# EAGLE design trackuino-standalone (EAGLE 5.08)
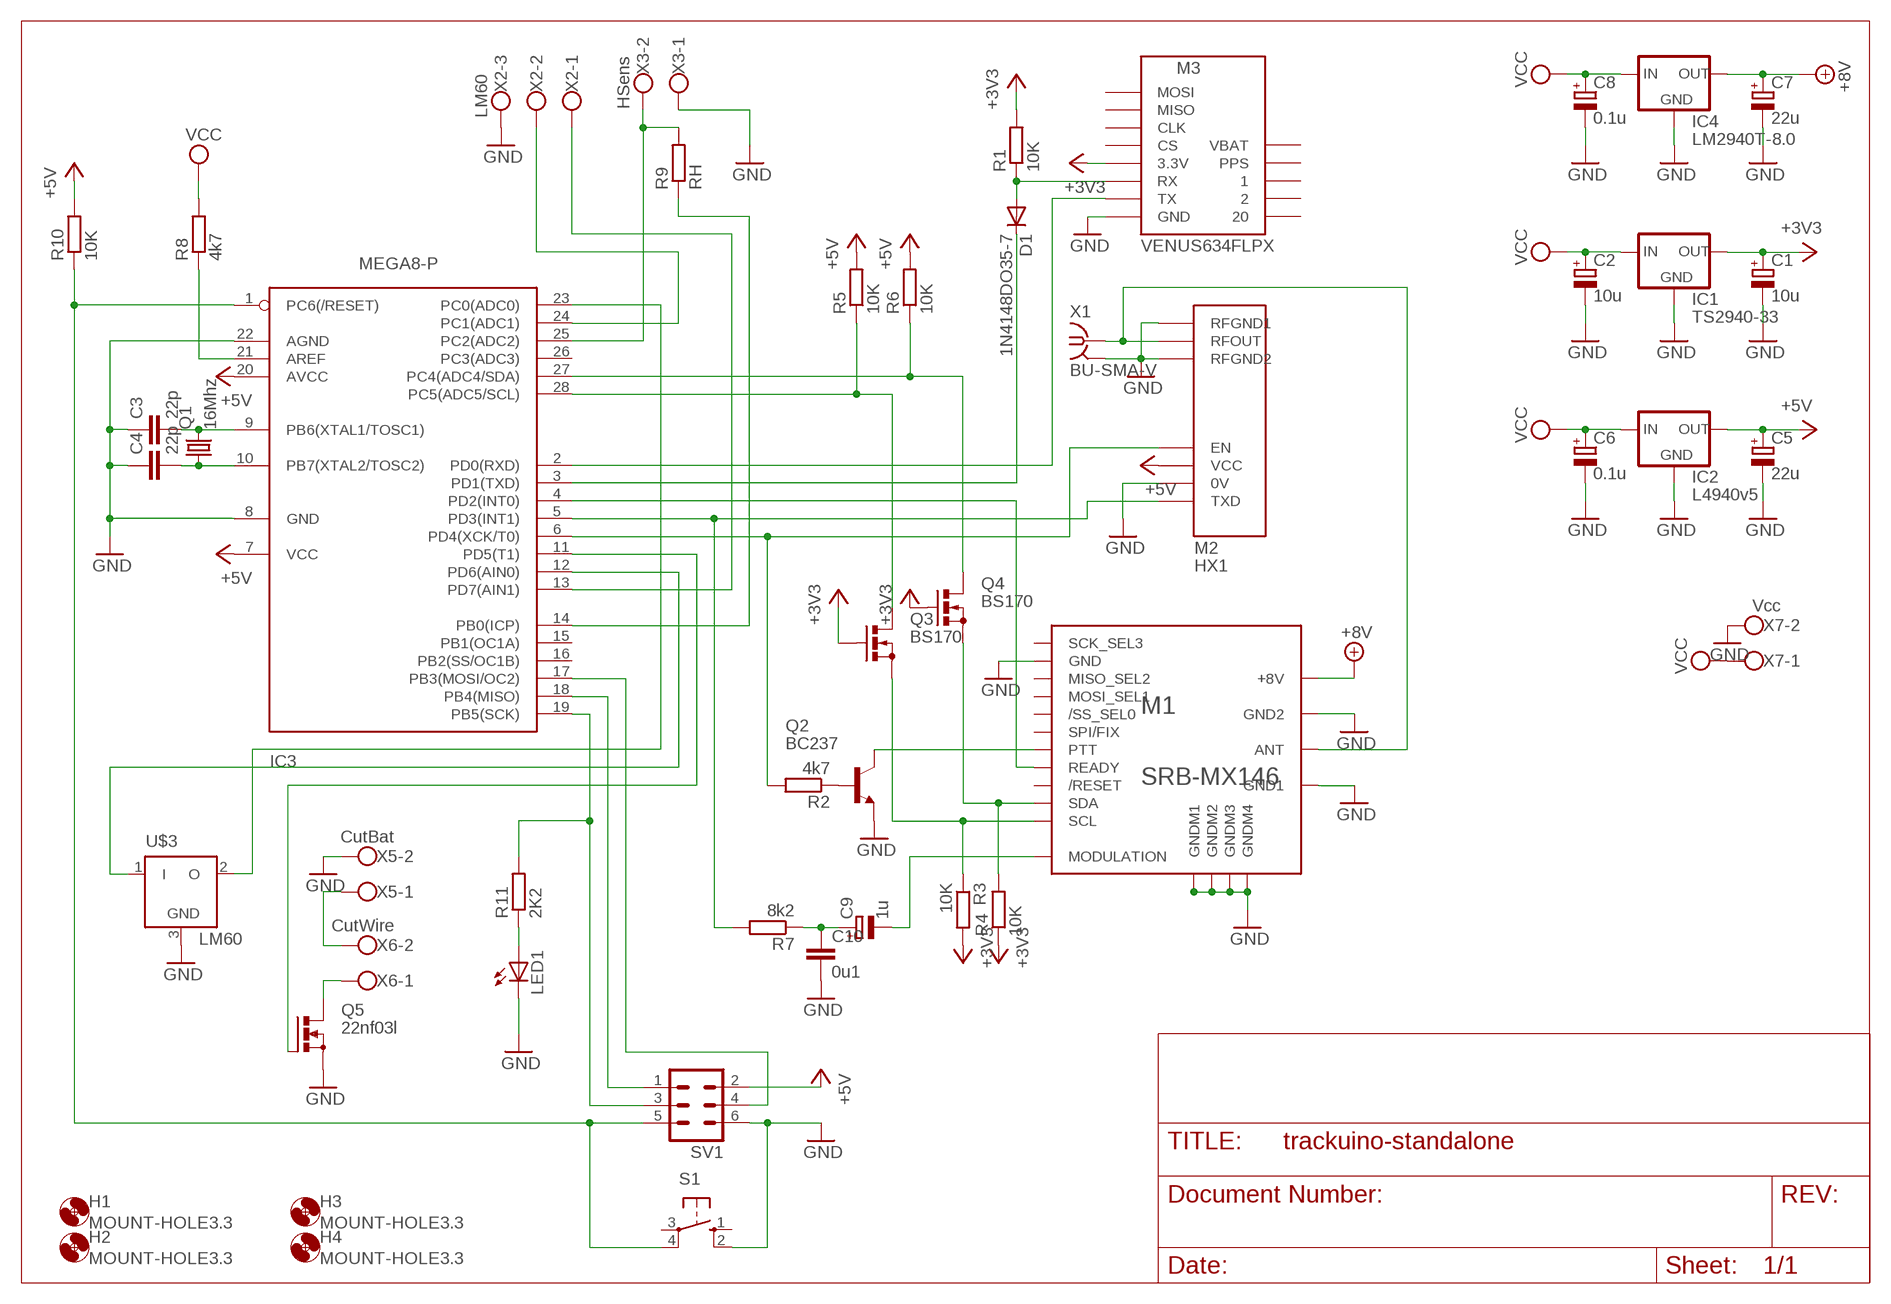
[diagram p0: schematic, sheet 1]

## Parts
C1  10u  CPOL-EUE2.5-5  [E2,5-5]
C2  10u  CPOL-EUE2.5-5  [E2,5-5]
C3  22p  C-EU025-025X050  [C025-025X050]
C4  22p  C-EU025-025X050  [C025-025X050]
C5  22u  CPOL-EUE2.5-5  [E2,5-5]
C6  0.1u  CPOL-EUE2.5-5  [E2,5-5]
C7  22u  CPOL-EUE2.5-5  [E2,5-5]
C8  0.1u  CPOL-EUE2.5-5  [E2,5-5]
C9  1u  CPOL-EUE2.5-5  [E2,5-5]
C10  0u1  C-EU025-025X050  [C025-025X050]
D1  1N4148DO35-7  [DO35-7]
H1  MOUNT-HOLE3.3  [3,3]
H2  MOUNT-HOLE3.3  [3,3]
H3  MOUNT-HOLE3.3  [3,3]
H4  MOUNT-HOLE3.3  [3,3]
IC1  TS2940-33  78XXL  [78XXL]
IC2  L4940v5  78XXL  [78XXL]
IC3  MEGA8-P  [DIL28-3]
IC4  LM2940T-8.0  78XXL  [78XXL]
LED1  LED3MM  [LED3MM]
M1  SRB-MX146  [SRB-MX146]
M2  HX1  [HX1]
M3  VENUS634FLPX  [VENUS634FLPX]
Q1  16Mhz  CRYSTALHC49S  [HC49/S]
Q2  BC237  [TO92]
Q3  BS170  [SOT54E]
Q4  BS170  [SOT54E]
Q5  22nf03l  PMOSFET_NTO220BH  [TO220BH]
R1  10K  R-EU_0204/5  [0204/5]
R2  4k7  R-EU_0204/5  [0204/5]
R3  10K  R-EU_0204/5  [0204/5]
R4  10K  R-EU_0204/5  [0204/5]
R5  10K  R-EU_0204/5  [0204/5]
R6  10K  R-EU_0204/5  [0204/5]
R7  8k2  R-EU_0204/5  [0204/5]
R8  4k7  R-EU_0204/5  [0204/5]
R9  RH  R-EU_0204/5  [0204/5]
R10  10K  R-EU_0204/5  [0204/5]
R11  2K2  R-EU_0204/5  [0204/5]
S1  10-XX  [B3F-10XX]
SV1  MA03-2  [MA03-2]
U$3  LM60  [TO92]
X1  BU-SMA-V  [BU-SMA-V]
X2  LM60  W237-103  [W237-103]
X3  HSens  W237-102  [W237-102]
X5  CutBat  W237-102  [W237-102]
X6  CutWire  W237-102  [W237-102]
X7  Vcc  W237-102  [W237-102]

## Nets
+3V3: C1.+ IC1.OUT M3.3.3V Q3.G Q4.G R1.2 R3.2 R4.1
+5V: C5.+ IC2.OUT IC3.7(VCC) IC3.20(AVCC) M2.VCC R5.2 R6.2 R10.2 SV1.2
+8V: C7.+ IC4.OUT M1.+8V
GND: C1.- C2.- C3.1 C4.1 C5.- C6.- C7.- C8.- C10.2 IC1.GND IC2.GND IC3.8(GND) IC3.22(AGND) IC4.GND LED1.K(C) M1.GND M1.GND1 M1.GND2 M1.GNDM1 M1.GNDM2 M1.GNDM3 M1.GNDM4 M2.0V M2.RFGND1 M2.RFGND2 M3.GND Q2.1(E) Q5.S S1.2(S1) SV1.6 U$3.3(GND) X1.2(GND) X2.3 X3.1 X5.2 X7.2
N$1: IC3.21(AREF) R8.1
N$2: M1.ANT M2.RFOUT X1.1
N$3: C3.2 IC3.9(PB6(XTAL1/TOSC1)) Q1.2
N$4: C4.2 IC3.10(PB7(XTAL2/TOSC2)) Q1.1
N$5: IC3.4(PD2(INT0)) M1.PRE2(READY)
N$6: IC3.5(PD3(INT1)) M2.TXD R7.2
N$7: IC3.6(PD4(XCK/T0)) M2.EN R2.2
N$8: IC3.12(PD6(AIN0)) U$3.1(I)
N$9: IC3.2(PD0(RXD)) M3.TX
N$10: D1.C IC3.3(PD1(TXD))
N$11: D1.A M3.RX R1.1
N$12: IC3.14(PB0(ICP)) R9.1
N$13: C9.+ C10.1 R7.1
N$14: Q2.2(B) R2.1
N$15: M1.PRE1(PTT) Q2.3(C)
N$16: M1.SDA Q4.S R4.2
N$17: IC3.27(PC4(ADC4/SDA)) Q4.D R6.1
N$18: IC3.28(PC5(ADC5/SCL)) Q3.D R5.1
N$19: M1.SCL Q3.S R3.1
N$20: C9.- M1.MOD(MODULATION)
N$22: IC3.11(PD5(T1)) Q5.G
N$23 [HIGH Current]: X5.1 X6.2
N$24 [HIGH Current]: Q5.D X6.1
N$25: IC3.23(PC0(ADC0)) U$3.2(O)
N$26: IC3.13(PD7(AIN1)) X2.1
N$27: IC3.24(PC1(ADC1)) X2.2
N$29: IC3.18(PB4(MISO)) SV1.1
N$30: IC3.19(PB5(SCK)) R11.2 SV1.3
N$31: IC3.17(PB3(MOSI/OC2)) SV1.4
N$32: IC3.1(PC6(/RESET)) R10.1 S1.4(P1) SV1.5
N$33: LED1.A R11.1
N$77: IC3.25(PC2(ADC2)) R9.2 X3.2
VCC: C2.+ C6.+ C8.+ IC1.IN IC2.IN IC4.IN R8.2 X7.1
Unconnected: IC3.15(PB1(OC1A)) IC3.16(PB2(SS/OC1B)) IC3.26(PC3(ADC3)) M1./RES(/RESET) M1./SS(/SS_SEL0) M1.MISO(MISO_SEL2) M1.MOSI(MOSI_SEL1) M1.PRE0(SPI/FIX) M1.SCK(SCK_SEL3) M3.1 M3.2 M3.20 M3.CLK M3.CS M3.MISO M3.MOSI M3.PPS M3.VBAT S1.1(S) S1.3(P)

## Power pins joined to a net without a drawn wire
GND: X1.3(GND) X1.4(GND) X1.5(GND)

## Library data of the parts
C1 C2 C5-C9 = rcl:CPOL-EU: POLARIZED CAPACITOR, European symbol
C3 C4 C10 = rcl:C-EU: CAPACITOR, European symbol
D1 = diode:1N4148: DIODE high speed (Philips)
H1-H4 = holes:MOUNT-HOLE: MOUNTING HOLE with drill center marker
IC1 IC2 IC4 = v-reg:78XXL: VOLTAGE REGULATOR
IC3 = avr-6:MEGA8-P: MICROCONTROLLER 8 Kbytes FLASH 1 kbytes SRAM 512 bytes EEPROM USART 4-channel 10 bit ADC 2-channel 8 bit ADC
LED1 = led:LED: LED OSRAM: - CHIPLED LG R971, LG N971, LY N971, LG Q971, LY Q971, LO R971, LY R971 LH N974, LH R974 LS Q976, LO Q976, LY Q976 LO Q996 - Hyper CHIPLED LW Q18S LB Q993, LB Q99A, LB R99A - SideLED LS A670, LO A670, LY A670, LG A670, LP A670 LB A673, LV A673, LT A673, LW A673 LH A674 LY A675 LS A676, LA A676, LO A676, LY A676, LW A676 LS A679, LY A679, LG A679 - Hyper Micro SIDELED® LS Y876, LA Y876, LO Y876, LY Y876 LT Y87S - SmartLED LW L88C, LW L88S LB L89C, LB L89S, LG L890 LS L89K, LO L89K, LY L89K LS L896, LA L896, LO L896, LY L896 - TOPLED LS T670, LO T670, LY T670, LG T670, LP T670 LSG T670, LSP T670, LSY T670, LOP T670, LYG T670 LG T671, LOG T671, LSG T671 LB T673, LV T673, LT T673, LW T673 LH T674 LS T676, LA T676, LO T676, LY T676, LB T676, LH T676, LSB T676, LW T676 LB T67C, LV T67C, LT T67C, LS T67K, LO T67K, LY T67K, LW E67C LS E67B, LA E67B, LO E67B, LY E67B, LB E67C, LV E67C, LT E67C LW T67C LS T679, LY T679, LG T679 LS T770, LO T770, LY T770, LG T770, LP T770 LB T773, LV T773, LT T773, LW T773 LH T774 LS E675, LA E675, LY E675, LS T675 LS T776, LA T776, LO T776, LY T776, LB T776 LHGB T686 LT T68C, LB T68C - Hyper Mini TOPLED® LB M676 - Mini TOPLED Santana® LG M470 LS M47K, LO M47K, LY M47K Source: http://www.osram.convergy.de LUXEON: - LUMILED® LXK2-PW12-R00, LXK2-PW12-S00, LXK2-PW14-U00, LXK2-PW14-V00 LXK2-PM12-R00, LXK2-PM12-S00, LXK2-PM14-U00 LXK2-PE12-Q00, LXK2-PE12-R00, LXK2-PE12-S00, LXK2-PE14-T00, LXK2-PE14-U00 LXK2-PB12-K00, LXK2-PB12-L00, LXK2-PB12-M00, LXK2-PB14-N00, LXK2-PB14-P00, LXK2-PB14-Q00 LXK2-PR12-L00, LXK2-PR12-M00, LXK2-PR14-Q00, LXK2-PR14-R00 LXK2-PD12-Q00, LXK2-PD12-R00, LXK2-PD12-S00 LXK2-PH12-R00, LXK2-PH12-S00 LXK2-PL12-P00, LXK2-PL12-Q00, LXK2-PL12-R00 Source: www.luxeon.com KINGBRIGHT: KA-3528ASYC Source: www.kingbright.com
M1 = SRB:SRB-MX146: 2m/VHF transmitter module
M2 = trackuino:HX1
M3 = trackuino:VENUS634FLPX
Q1 = crystal:CRYSTAL: CRYSTAL
Q2 = transistor-npn:BC237: NPN Transistor
Q3 Q4 = transistor-small-signal:BS170: N-CHANNEL MOS FET
Q5 = transistor-power:PMOSFET_N: Power MOSFET N-Channel
R1-R11 = rcl:R-EU_: RESISTOR, European symbol
S1 = switch-omron:10-XX: OMRON SWITCH
SV1 = con-lstb:MA03-2: PIN HEADER
U$3 = trackuino:LM60
X1 = con-coax:BU-SMA-V: FEMALE SMA CONNECTOR Radiall distributor RS 112-3794
X2 = con-wago-500:W237-103: WAGO SCREW CLAMP
X3 X5-X7 = con-wago-500:W237-102: WAGO SCREW CLAMP

## Net classes
0 10: width 0.254 mm
1 15: width 0.381 mm
2 20: width 0.508 mm
3 30: width 0.762 mm
4 40: width 1.016 mm
5 50: width 1.27 mm
6 HIGH Current: width 2.54 mm

## Board
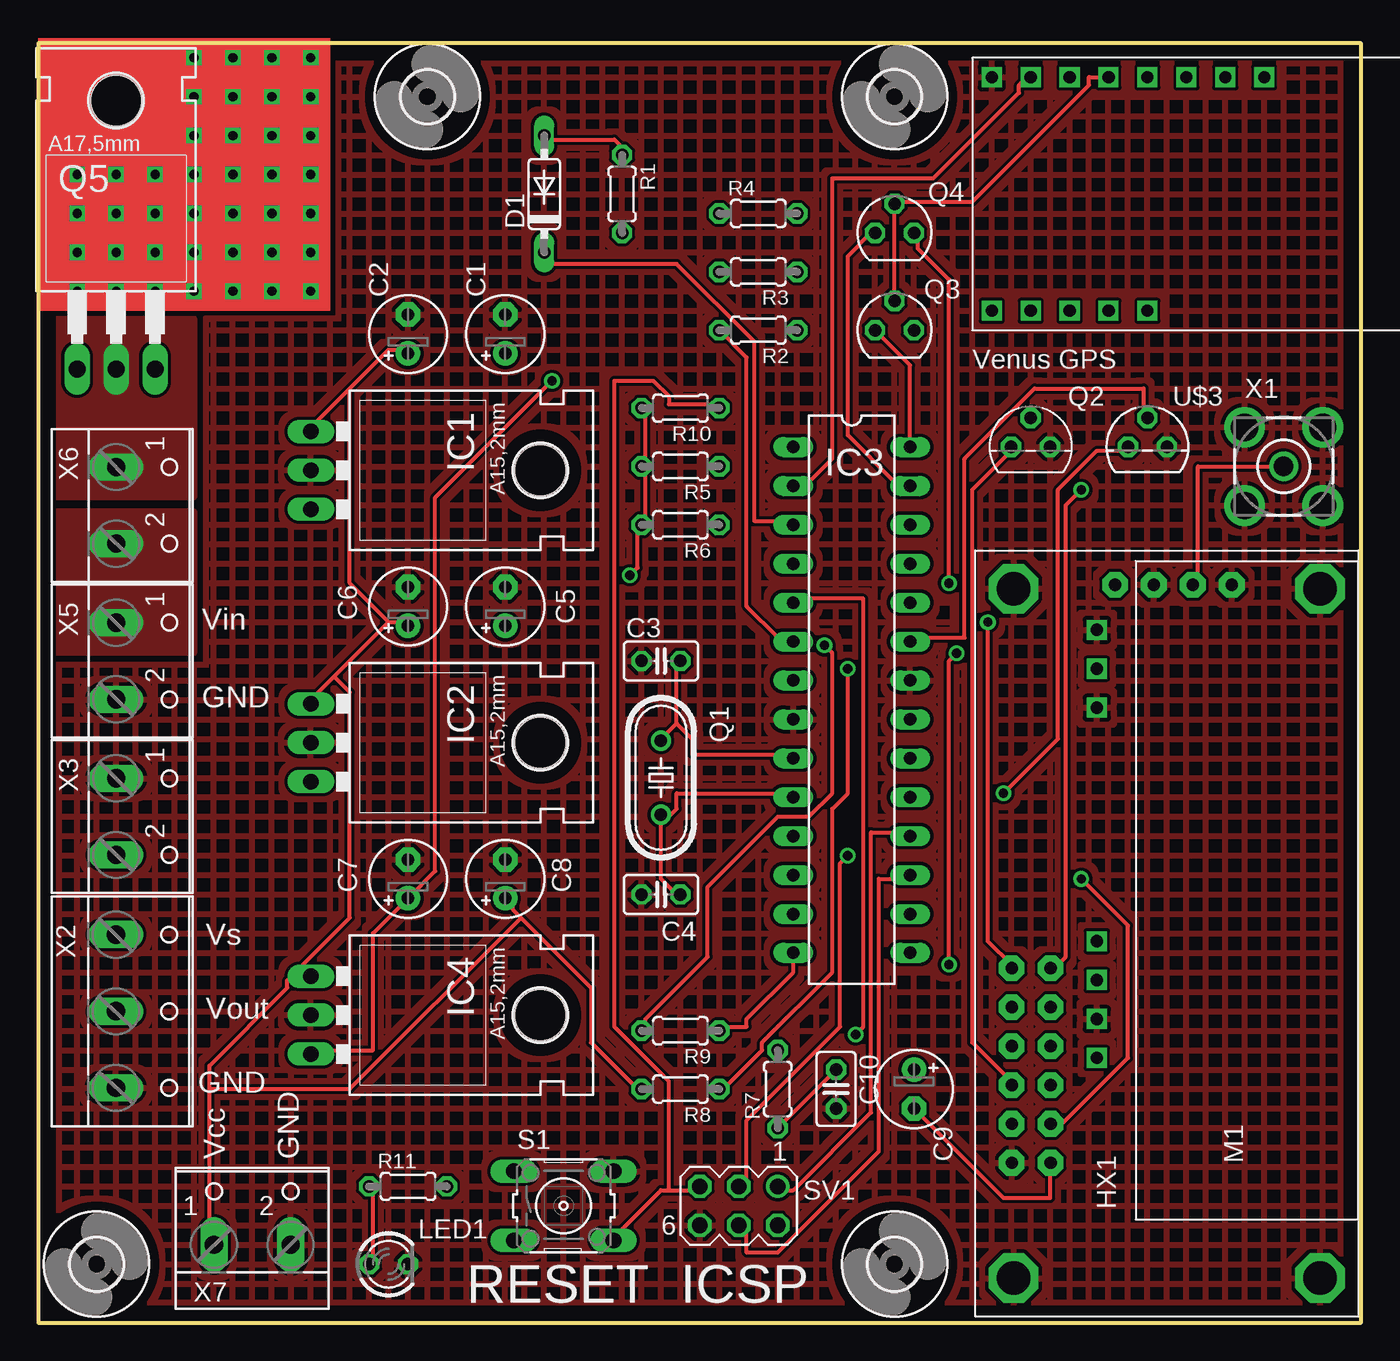
[diagram p1: board, top side]
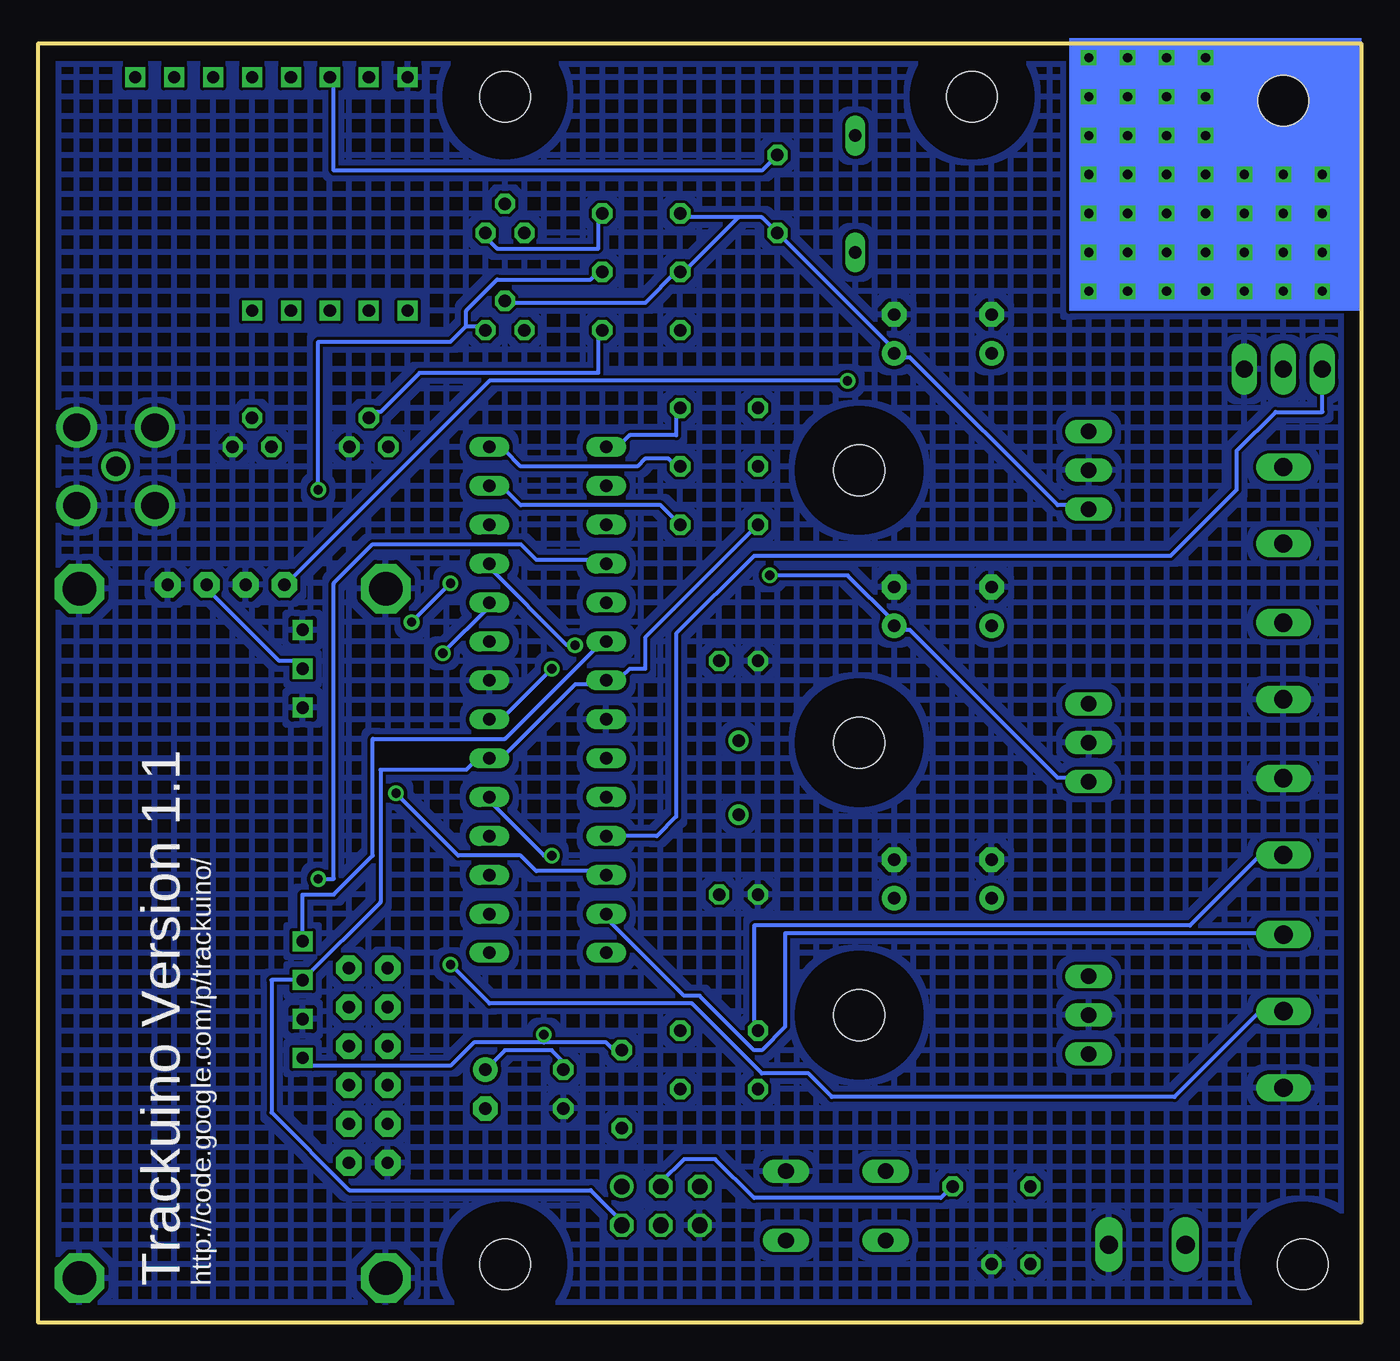
[diagram p2: board, bottom side, seen from below]

Size 86.34 x 83.49 mm. Coordinates in mm from the lower left corner, seen from the top.
Outline: 0,0 86.34,0 86.34,83.49 0,83.49 0,0
Copper layers (1*16): Top 0.035mm / dielectric 1.5mm / Bottom 0.035mm
Design rules "default": minimum track width 10mil, minimum drill 24mil, track to track 8mil, track to pad 8mil, pad to pad 8mil, via to via 8mil, smd to smd 8mil, copper to edge 40mil, drill to drill 8mil, minimum pad ring 10mil, minimum via ring 8mil, stop-mask expansion 4mil, vias tented up to drill 0mil, thermal gap 10mil

### Footprints (pad centres in the part's own frame; a part is rotated, then mirrored left to right if it is on the bottom)
E2,5-5 = drill 0.813 pad 1.6 round: + -1.27,0 | drill 0.813 pad 1.6 octagon: - 1.27,0
C025-025X050 = drill 0.813 octagon: 1 -1.27,0; 2 1.27,0
DO35-7 = drill 0.813 long: A 3.81,0; C -3.81,0
3,3 = hole 3.3: 0,0
78XXL = drill 1.016 long: GND 0,-3.81; IN -2.54,-3.81; OUT 2.54,-3.81 | hole 3.302: 0,11.176
DIL28-3 = drill 0.813 long: 1 -16.51,-3.81; 2 -13.97,-3.81; 3 -11.43,-3.81; 4 -8.89,-3.81; 5 -6.35,-3.81; 6 -3.81,-3.81; 7 -1.27,-3.81; 8 1.27,-3.81; 9 3.81,-3.81; 10 6.35,-3.81; 11 8.89,-3.81; 12 11.43,-3.81; 13 13.97,-3.81; 14 16.51,-3.81; 15 16.51,3.81; 16 13.97,3.81; 17 11.43,3.81; 18 8.89,3.81; 19 6.35,3.81; 20 3.81,3.81; 21 1.27,3.81; 22 -1.27,3.81; 23 -3.81,3.81; 24 -6.35,3.81; 25 -8.89,3.81; 26 -11.43,3.81; 27 -13.97,3.81; 28 -16.51,3.81
LED3MM = drill 0.813 octagon: A -1.27,0; K 1.27,0
SRB-MX146 = drill 0.8 pad 1.676 octagon: +8V 22.755,3.389; /RES -12.435,10.125; /SS -7.355,7.585; ANT 22.755,-1.691; GND -14.975,10.125; GND1 22.755,0.849; GND2 22.755,-4.231; MISO -4.815,7.585; MOD -14.975,7.585; MOSI -7.355,10.125; PRE0 -9.895,7.585; PRE1 -9.895,10.125; PRE2 -12.435,7.585; SCK -4.815,10.125; SCL -2.275,7.585; SDA -2.275,10.125 | drill 2.2 octagon: GNDM1 -22.5,10; GNDM2 22.5,10; GNDM3 22.5,-10; GNDM4 -22.5,-10
HX1 = drill 0.8 square: 0V 25.4,-8.89; EN 20.32,-8.89; RFGND1 0,-8.89; RFGND2 5.08,-8.89; RFOUT 2.54,-8.89; TXD 27.94,-8.89; VCC 22.86,-8.89
VENUS634FLPX = drill 0.8 square: 1 6.35,1.27; 2 3.81,1.27; 3.3V 8.89,16.51; 20 1.27,1.27; CLK 13.97,16.51; CS 11.43,16.51; GND 1.27,16.51; MISO 16.51,16.51; MOSI 19.05,16.51; PPS 8.89,1.27; RX 6.35,16.51; TX 3.81,16.51; VBAT 11.43,1.27
HC49/S = drill 0.813 round: 1 -2.413,0; 2 2.413,0
TO92 = drill 0.813 octagon: 1 1.27,0; 2 0,1.905; 3 -1.27,0
SOT54E = drill 0.813 octagon: D -1.27,0; G 0,1.905; S 1.27,0
TO220BH = drill 1.118 long: D 0,-6.35; G -2.54,-6.35; S 2.54,-6.35 | hole 3.302: 0,11.176
0204/5 = drill 0.813 octagon: 1 -2.54,0; 2 2.54,0
B3F-10XX = drill 1.016 long: 1 -3.251,2.261; 2 3.251,2.261; 3 -3.251,-2.261; 4 3.251,-2.261
MA03-2 = drill 1.016 round: 1 -2.54,-1.27 | drill 1.016 octagon: 2 -2.54,1.27; 3 0,-1.27; 4 0,1.27; 5 2.54,-1.27; 6 2.54,1.27
TO92' = drill 0.813 octagon: 1 -1.27,0; 2 0,1.905; 3 1.27,0
BU-SMA-V = drill 1.27 round: 1 0,0 | drill 1.778 round: 2 -2.55,2.55; 3 2.55,2.55; 4 2.55,-2.55; 5 -2.55,-2.55
W237-103 = drill 1.194 long: 1 -5,-1.29; 2 0,-1.29; 3 5,-1.29
W237-102 = drill 1.194 long: 1 -2.5,-1.27; 2 2.5,-1.27

### Placement (x,y rotation side)
C1  30.48,64.52 90 top
C2  24.13,64.52 90 top
C3  40.64,43.18 0 top
C4  40.64,27.94 0 top
C5  30.48,46.74 90 top
C6  24.13,46.74 90 top
C7  24.13,28.96 90 top
C8  30.48,28.96 90 top
C9  57.15,15.24 270 top
C10  52.07,15.24 270 top
D1  33.02,73.66 90 top
H1  55.88,3.81 0 top
H2  25.4,80.01 0 top
H3  3.81,3.81 0 top
H4  55.88,80.01 0 top
IC1  21.59,55.63 270 top
IC2  21.59,37.85 270 top
IC3  53.09,40.64 270 top
IC4  21.59,20.07 270 top
LED1  22.86,3.81 0 top
M1  73.66,25.4 90 top
M2  77.98,45.21 270 top
M3  60.96,64.77 0 top
Q1  40.64,35.56 90 top
Q2  64.77,57.15 0 top
Q3  55.88,64.77 0 top
Q4  55.88,71.12 0 top
Q5  5.08,68.58 0 top
R1  38.1,73.66 270 top
R2  46.99,64.77 180 top
R3  46.99,68.58 180 top
R4  46.99,72.39 0 top
R5  41.91,55.88 180 top
R6  41.91,52.07 180 top
R7  48.26,15.24 90 top
R8  41.91,15.24 180 top
R9  41.91,19.05 180 top
R10  41.91,59.69 180 top
R11  24.13,8.89 0 top
S1  34.29,7.62 0 top
SV1  45.72,7.62 180 top
U$3  LM60  [TO92']  72.39,57.15 0 top
X1  81.28,55.88 0 top
X2  6.35,20.32 270 top
X3  6.35,33.02 270 top
X5  6.35,43.18 270 top
X6  6.35,53.34 270 top
X7  13.97,6.35 0 top

### Tracks (layer width: path | path; a pad name or v marks a point on that pad's centre or on a via)
+3V3
  Top 0.254: M3.3.3V 68.58,81.28 68.58,80.77 60.96,73.15 55.88,73.15 Q4.G Q3.G
  Bottom 0.254: IC1.OUT 17.78,53.34 19.81,53.34 29.46,62.99 30.48,62.99 C1.+ 30.48,63.5 R1.2 39.12,72.14 40.64,72.14 | 40.64,72.14 44.2,72.14 R4.1 | 40.64,72.14 44.2,68.58 R3.2 44.7,68.58 46.74,66.55 55.88,66.55 Q3.G
+5V  (via drill 0.61)
  Top 0.254: 39.62,55.88 39.62,52.32 R6.2 39.12,51.82 39.12,49.28 v38.61,48.77 | 39.62,55.88 39.62,59.44 R10.2 | 39.62,55.88 R5.2
  Bottom 0.254: IC2.OUT 17.78,35.56 19.81,35.56 29.46,45.21 30.48,45.21 C5.+ 30.48,45.72 33.53,48.77 v38.61,48.77 | SV1.2 48.26,6.6 50.29,8.64 66.04,8.64 71.12,13.72 71.12,22.35 M2.VCC 64.01,27.43 64.01,36.07 58.42,36.07 57.91,36.58 56.9,36.58 IC3.20 56.9,37.08 55.88,37.08 51.31,41.66 49.28,41.66 IC3.7 49.28,42.16 48.26,42.16 47.75,42.67 46.74,42.67 46.74,44.7 R6.2
+8V  (via drill 0.61)
  Top 0.254: IC4.OUT 17.78,17.78 21.84,17.78 21.84,25.4 C7.+ 25.91,29.46 25.91,53.85 v33.53,61.47
  Bottom 0.254: v33.53,61.47 56.9,61.47 70.1,48.26 M1.+8V
GND
  pour Bottom (hatched): 0,0 86.36,0 86.36,83.82 0,83.82
  pour Top (hatched): 19.56,83.82 19.56,65.53 10.92,65.53 10.92,42.93 0,42.93 0,0 86.36,0 86.36,83.82
N$1  (via drill 0.61)
  Top 0.254: v52.83,42.67 52.83,34.54 51.82,33.53 51.82,22.86 47.24,18.29 47.24,17.78 44.7,15.24 R8.1
  Bottom 0.254: v52.83,42.67 55.88,39.62 56.9,39.62 IC3.21
N$2
  Top 0.254: X1.1 75.69,55.88 75.69,48.26 M1.ANT
  Bottom 0.254: M2.RFOUT 69.6,43.18 70.61,43.18 75.18,47.75 M1.ANT
N$3
  Top 0.254: 41.66,39.12 40.64,38.1 Q1.2 | 41.66,39.12 41.66,43.18 C3.2 | 41.66,39.12 42.67,38.1 42.67,37.08 49.28,37.08 IC3.9
N$4
  Top 0.254: 40.64,32.51 40.64,28.96 41.66,27.94 C4.2 | 40.64,32.51 41.66,33.53 41.66,34.54 49.28,34.54 IC3.10 | 40.64,32.51 Q1.1
N$5  (via drill 0.61)
  Top 0.254: v68.07,28.96 71.12,25.91 71.12,17.27 66.55,12.7 M1.PRE2
  Bottom 0.254: v68.07,28.96 67.06,28.96 67.06,48.26 64.52,50.8 54.86,50.8 53.85,49.78 49.28,49.78 IC3.4
N$6  (via drill 0.61)
  Top 0.254: v53.34,18.8 53.85,19.3 53.85,47.24 49.28,47.24 IC3.5
  Bottom 0.254: M2.TXD 68.58,16.76 59.44,16.76 57.91,18.29 53.34,18.29 | 53.34,18.29 49.28,18.29 48.77,17.78 R7.2 | 53.34,18.29 v53.34,18.8
N$7
  Top 0.254: R2.2 46.23,62.99 46.23,46.74 48.26,44.7 49.28,44.7 IC3.6
  Bottom 0.254: M2.EN 69.09,27.94 67.06,27.94 64.52,30.48 64.52,38.1 55.88,38.1 49.78,44.2 49.28,44.2 IC3.6
N$8  (via drill 0.61)
  Top 0.254: v62.99,34.54 66.55,38.1 66.55,54.36 69.09,56.9 71.12,56.9 U$3.1
  Bottom 0.254: v62.99,34.54 58.93,30.48 54.86,30.48 53.85,29.46 49.28,29.46 IC3.12
N$9
  Top 0.254: M3.TX 64.52,81.28 64.01,80.77 64.01,80.26 58.42,74.68 51.82,74.68 51.82,56.39 50.29,54.86 49.28,54.86 IC3.2
N$10
  Top 0.254: IC3.3 49.28,52.32 46.74,52.32 46.74,64.01 41.66,69.09 33.02,69.09 D1.C
N$11
  Top 0.254: R1.1 38.1,76.71 37.59,77.22 33.02,77.22 D1.A
  Bottom 0.254: R1.1 39.12,75.18 67.06,75.18 67.06,81.28 M3.RX
N$12
  Top 0.254: R9.1 44.7,19.3 46.23,19.3 46.23,19.81 49.28,22.86 IC3.14
N$13
  Top 0.254: R7.1 C10.1
  Bottom 0.254: C9.+ 55.88,17.78 52.83,17.78 51.82,16.76 C10.1
N$14
  Bottom 0.254: R2.1 49.78,64.52 49.78,61.98 61.47,61.98 64.01,59.44 64.52,59.44 Q2.2
N$15
  Top 0.254: Q2.3 63.5,56.9 60.96,54.36 60.96,18.29 63.5,15.75 M1.PRE1
N$16  (via drill 0.61)
  Top 0.254: v61.98,45.72 61.98,24.89 63.5,23.37 M1.SDA | v59.44,48.26 59.44,68.07 57.4,70.1 57.4,71.12 Q4.S
  Bottom 0.254: R4.2 49.78,72.14 49.78,70.1 56.39,70.1 57.4,71.12 Q4.S | v61.98,45.72 v59.44,48.26
N$17
  Top 0.254: Q4.D 54.36,71.12 52.83,69.6 52.83,57.91 55.88,54.86 56.9,54.86 IC3.27
  Bottom 0.254: R6.1 45.72,53.34 54.86,53.34 55.88,54.36 56.9,54.36 IC3.27
N$18
  Top 0.254: Q3.D 56.9,62.48 IC3.28
  Bottom 0.254: R5.1 44.7,55.88 45.21,56.39 46.74,56.39 47.24,55.88 54.86,55.88 55.88,56.9 56.9,56.9 IC3.28
N$19  (via drill 0.61)
  Top 0.254: v68.07,54.36 67.06,53.34 67.06,23.88 66.55,23.37 M1.SCL
  Bottom 0.254: 58.42,65.02 58.42,66.04 56.39,68.07 50.29,68.07 49.78,68.58 R3.1 | 58.42,65.02 57.4,65.02 Q3.S | v68.07,54.36 68.07,64.01 59.44,64.01 58.42,65.02
N$20
  Top 0.254: C9.- 62.99,8.13 66.04,8.13 66.04,10.16 M1.MOD
N$22
  Bottom 0.254: Q5.G 2.54,59.44 5.59,59.44 8.13,56.9 8.13,54.36 12.45,50.04 39.62,50.04 44.7,44.96 44.7,33.02 45.97,31.75 IC3.11
N$23
  pour Top (no thermals): 0,52.96 10.16,52.96 10.16,43.69 0,43.69
N$24
  pour Top (no thermals): 10.16,53.85 0,53.85 0,65.53 10.16,65.53
N$25
  Top 0.254: IC3.23 56.9,44.7 60.45,44.7 60.45,56.39 65.02,60.96 72.14,60.96 72.14,59.44 U$3.2
N$26
  Bottom 0.254: IC3.13 49.28,26.42 44.2,21.34 43.18,21.34 39.62,17.78 39.12,17.78 37.59,19.3 37.59,25.4 5.08,25.4 X2.1
N$27  (via drill 0.61)
  Top 0.254: v59.94,43.69 59.44,43.18 v59.44,23.37
  Bottom 0.254: v59.94,43.69 56.9,46.74 IC3.24 | v59.44,23.37 56.9,20.83 43.69,20.83 39.12,16.26 36.07,16.26 34.54,14.73 12.19,14.73 6.6,20.32 X2.2
N$29
  Top 0.254: IC3.18 56.9,32 54.36,32 54.36,13.72 49.28,8.64 48.26,8.64 SV1.1
N$30  (via drill 0.61)
  Top 0.254: v52.83,30.48 52.32,29.97 52.32,19.3 46.23,13.21 46.23,9.14 45.72,8.64 SV1.3
  Bottom 0.254: R11.2 27.43,8.13 39.62,8.13 42.16,10.67 44.2,10.67 45.72,9.14 SV1.3 | v52.83,30.48 53.34,30.48 56.9,34.04 IC3.19
N$31
  Top 0.254: IC3.17 56.9,28.96 54.86,28.96 54.86,11.18 48.26,4.57 46.23,4.57 46.23,6.1 45.72,6.6 SV1.4
N$32
  Top 0.254: 41.15,8.64 43.18,8.64 SV1.5 | 41.15,8.64 40.64,8.64 37.59,5.59 S1.4 | 41.15,8.64 41.15,15.75 37.59,19.3 37.59,61.47 40.13,61.47 41.15,60.45 41.15,59.94 44.2,59.94 R10.1
  Bottom 0.254: R10.1 44.7,59.44 44.7,57.91 47.75,57.91 48.26,57.4 49.28,57.4 IC3.1
N$33
  Top 0.254: LED1.A 21.84,4.06 21.84,8.64 R11.1
N$37  (via drill 0.6)
  other vias: 17.78,67.31
N$38  (via drill 0.6)
  other vias: 17.78,69.85
N$39  (via drill 0.6)
  other vias: 17.78,72.39
N$40  (via drill 0.6)
  other vias: 17.78,74.93
N$41  (via drill 0.6)
  other vias: 17.78,77.47
N$42  (via drill 0.6)
  other vias: 17.78,80.01
N$43  (via drill 0.6)
  other vias: 17.78,82.55
N$44  (via drill 0.6)
  other vias: 15.24,67.31
N$45  (via drill 0.6)
  other vias: 15.24,69.85
N$46  (via drill 0.6)
  other vias: 15.24,72.39
N$47  (via drill 0.6)
  other vias: 15.24,74.93
N$48  (via drill 0.6)
  other vias: 15.24,77.47
N$49  (via drill 0.6)
  other vias: 15.24,80.01
N$50  (via drill 0.6)
  other vias: 15.24,82.55
N$51  (via drill 0.6)
  other vias: 12.7,67.31
N$52  (via drill 0.6)
  other vias: 12.7,69.85
N$53  (via drill 0.6)
  other vias: 12.7,72.39
N$54  (via drill 0.6)
  other vias: 12.7,74.93
N$55  (via drill 0.6)
  other vias: 12.7,77.47
N$56  (via drill 0.6)
  other vias: 12.7,80.01
N$57  (via drill 0.6)
  other vias: 12.7,82.55
N$58  (via drill 0.6)
  other vias: 10.16,67.31
N$59  (via drill 0.6)
  other vias: 10.16,69.85
N$60  (via drill 0.6)
  other vias: 10.16,72.39
N$61  (via drill 0.6)
  other vias: 10.16,74.93
N$62  (via drill 0.6)
  other vias: 10.16,77.47
N$63  (via drill 0.6)
  other vias: 10.16,80.01
N$64  (via drill 0.6)
  other vias: 10.16,82.55
N$65  (via drill 0.6)
  other vias: 7.62,67.31
N$66  (via drill 0.6)
  other vias: 7.62,69.85
N$67  (via drill 0.6)
  other vias: 7.62,72.39
N$68  (via drill 0.6)
  other vias: 7.62,74.93
N$69  (via drill 0.6)
  other vias: 5.08,67.31
N$70  (via drill 0.6)
  other vias: 5.08,69.85
N$71  (via drill 0.6)
  other vias: 5.08,72.39
N$72  (via drill 0.6)
  other vias: 5.08,74.93
N$73  (via drill 0.6)
  other vias: 2.54,67.31
N$74  (via drill 0.6)
  other vias: 2.54,69.85
N$75  (via drill 0.6)
  other vias: 2.54,72.39
N$76  (via drill 0.6)
  other vias: 2.54,74.93
N$77  (via drill 0.61)
  Top 0.254: v51.31,44.2 51.82,43.69 51.82,34.54 50.29,33.02 48.26,33.02 43.69,28.45 43.69,23.88 39.62,19.81 39.62,19.3 R9.2
  Bottom 0.254: R9.2 39.62,19.3 39.62,25.91 11.18,25.91 6.6,30.48 5.08,30.48 X3.2 | v51.31,44.2 51.82,44.2 56.9,49.28 IC3.25
VCC
  Top 0.254: 19.3,42.16 22.86,45.72 | 19.3,42.16 17.78,40.64 IC2.IN | 22.86,45.72 23.88,45.72 C6.+ | 20.32,60.96 22.86,63.5 23.88,63.5 C2.+ | 20.32,60.96 17.78,58.42 IC1.IN | 22.86,45.72 20.32,48.26 20.32,60.96 | 31.5,26.42 30.99,26.92 30.99,27.43 30.48,27.94 C8.+ | 31.5,26.42 36.07,21.84 36.07,18.29 39.12,15.24 R8.2 | 17.27,22.35 16.26,22.35 16.26,21.84 11.18,16.76 11.18,15.24 | 17.27,22.35 17.78,22.35 IC4.IN 17.27,22.35 | 11.18,15.24 11.18,5.08 X7.1 | 31.5,26.42 20.32,15.24 11.18,15.24 | 19.3,42.16 20.32,41.15 20.32,26.42 17.27,23.37 17.27,22.35
(copper drawn outside any net)
  shapes: Bottom area x1, Top area x1

### Text on the board
tPlace: Vin | GND | Vs | Vout | GND | Vcc | GND | RESET | ICSP
bPlace: http://code.google.com/p/trackuino/ | Trackuino Version 1.1